# Altium project BTS7970.PrjPCB
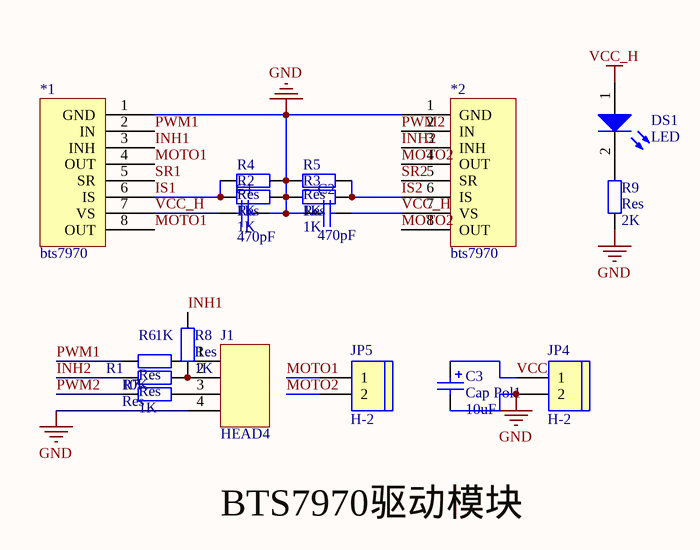
[diagram p0: BTS7970.SchDoc]
1 sheet, 18 parts. Net scope: global (net labels, ports and power ports of the same name join across sheets).
Board file: bts7970.PcbDoc

## Sheet BTS7970.SchDoc
size A4

### Parts
*1  bts7970  [bts7970]
*2  bts7970  [bts7970]
C1  value 470pF  [CC1005-0402]  (hidden comment: CAP)
C2  value 470pF  [CC1005-0402]  (hidden comment: CAP)
C3  Cap Pol1  value 10uF  [RB0.15-0.32]
DS1  LED  [LED0.1-0.22]
J1  HEAD4  [HDR1-4]
JP4  H-2  [H-2/2-T]
JP5  H-2  [H-2/2-T]
R1  Res  value 1K  [R2012-0805]
R2  Res  value 1K  [R2012-0805]
R3  Res  value 1K  [R2012-0805]
R4  Res  value 1K  [R2012-0805]
R5  Res  value 1K  [R2012-0805]
R6  Res  value 1K  [R2012-0805]
R7  Res  value 10K  [R2012-0805]
R8  Res  value 1K  [R2012-0805]
R9  Res  value 2K  [R2012-0805]

### Nets
GND: *1.1(GND) *2.1(GND) C1.2 C2.1 C3.2 J1.4 JP4.2 R2.1 R3.2 R4.1 R5.2 R9.1
VCC_H: *1.7(VS) *2.7(VS) C1.1 C2.2 C3.1 DS1.1(A) JP4.1
INH1: *1.3(INH) R8.2
INH2: *2.3(INH) R1.2
IS1: *1.6(IS) R2.2 R4.2
IS2: *2.6(IS) R3.1 R5.1
MOTO1: *1.4(OUT) *1.8(OUT) JP5.1
MOTO2: *2.4(OUT) *2.8(OUT) JP5.2
PWM1: *1.2(IN) R6.2
PWM2: *2.2(IN) R7.2
SR1: *1.5(SR)
SR2: *2.5(SR)
NetDS1_2: DS1.2(K) R9.2
NetJ1_1: J1.1 R6.1
NetJ1_2: J1.2 R1.1 R8.1
NetJ1_3: J1.3 R7.1

### Notes on the sheet
- Labels drawn without touching a wire or pin: BTS7970驱动模块

### Library data of the parts
C1 C2 = CAP: Capacitor; Manufacturer: Generic Components; Class: Passive; Published: 08/06/2000; Publisher: Altium Hobart Technology Centre; SubClass: Capacitor
C3 = Cap Pol1: Polarized Capacitor (Radial); Manufacturer: Generic Components; Class: Passive; Published: 08/06/2000; Publisher: Altium Hobart Technology Centre; SubClass: Capacitor
DS1 = LED: Typical RED, GREEN, YELLOW, AMBER GaAs LED; Manufacturer: Generic Components; Class: Optoelectronic; Published: 08/06/2000; Publisher: Altium Hobart Technology Centre; SubClass: LED
J1 = HEAD4: Connector,4-pin; Class: Connector
JP4 JP5 = H-2: Header, 2-Pin; Manufacturer: Generic Components; Class: Connector
R1-R9 = Res: Resistor; Manufacturer: Generic Components; Class: Passive; Published: 08/06/2000; Publisher: Altium Hobart Technology Centre; SubClass: Resistor